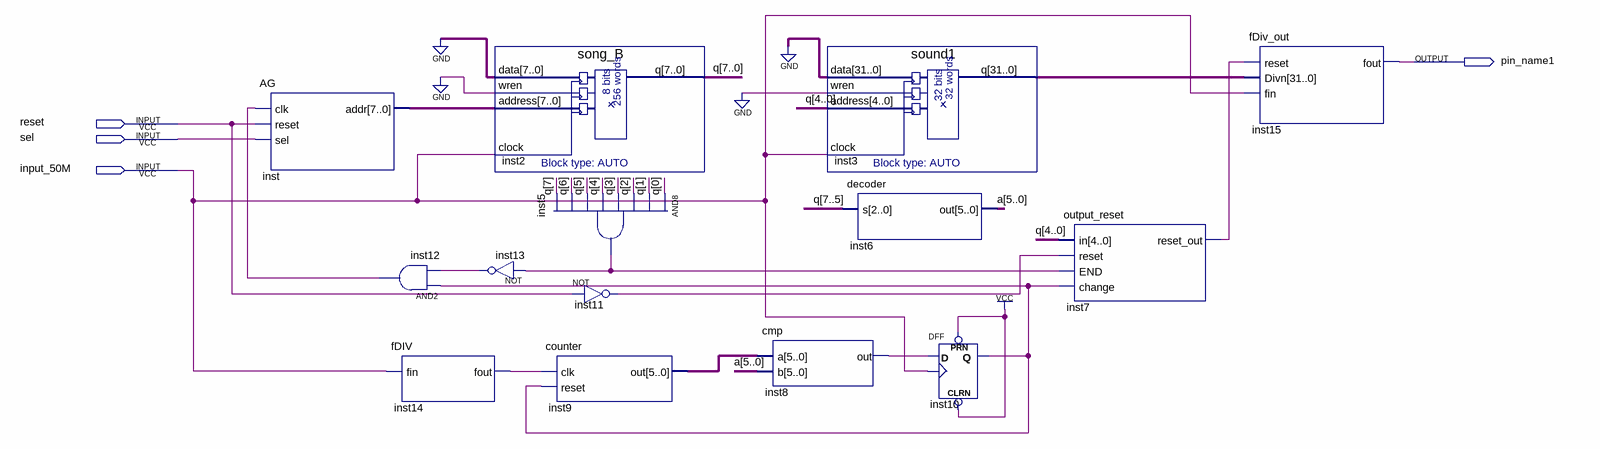
[diagram p0: schematic sheet]
// Quartus schematic music_box.bdf as structural Verilog: 14 symbols, 4 pins
module music_box (
  input  reset,
  input  sel,
  input  input_50M,
  output pin_name1
);

  wire inst5_out, inst7_reset_out, inst8_out, inst10_q, inst11_out, inst12_out, inst13_out, inst14_fout;
  wire [5:0] a, inst9_out;
  wire [7:0] inst_addr, q;
  wire [31:0] inst3_q;

  AG inst (.clk(inst12_out), .reset(reset), .sel(sel), .addr(inst_addr));
  and inst12 (inst12_out, inst10_q, inst13_out);
  fDIV inst14 (.fin(input_50M), .fout(inst14_fout));
  song_B inst2 (.data({8{1'b0}}), .wren(1'b0), .address(inst_addr), .clock(input_50M), .q(q));
  not inst13 (inst13_out, inst5_out);
  and inst5 (inst5_out, q[0], q[1], q[2], q[3], q[4], q[5], q[6], q[7]);
  not inst11 (inst11_out, reset);
  counter inst9 (.clk(inst14_fout), .reset(inst10_q), .out(inst9_out));
  cmp inst8 (.a(inst9_out), .b(a), .out(inst8_out));
  sound1 inst3 (.data({32{1'b0}}), .wren(1'b0), .address(q[4:0]), .clock(input_50M), .q(inst3_q));
  decoder inst6 (.s(q[7:5]), .out(a));
  DFF inst10 (.CLRN(1'b1), .CLK(input_50M), .D(inst8_out), .PRN(1'b1), .Q(inst10_q));
  output_reset inst7 (.in(q[4:0]), .reset(inst11_out), .END(inst5_out), .change(inst10_q), .reset_out(inst7_reset_out));
  fDiv_out inst15 (.reset(inst7_reset_out), .Divn(inst3_q), .fin(input_50M), .fout(pin_name1));
endmodule
